# EasyEDA Pro project ProPrj_主控板v1.0_2025-02-24.epro, schematic Schematic3
Board Name: 主控扩展板V2.0; Create Date: 2025-01-02; Page Name: P1; Project Name: 主控板v1.0; Schematic Name: Schematic3; Update Date: 2025-01-03; Company: 嘉立创EDA; Page Size: A4; Version: V1.0
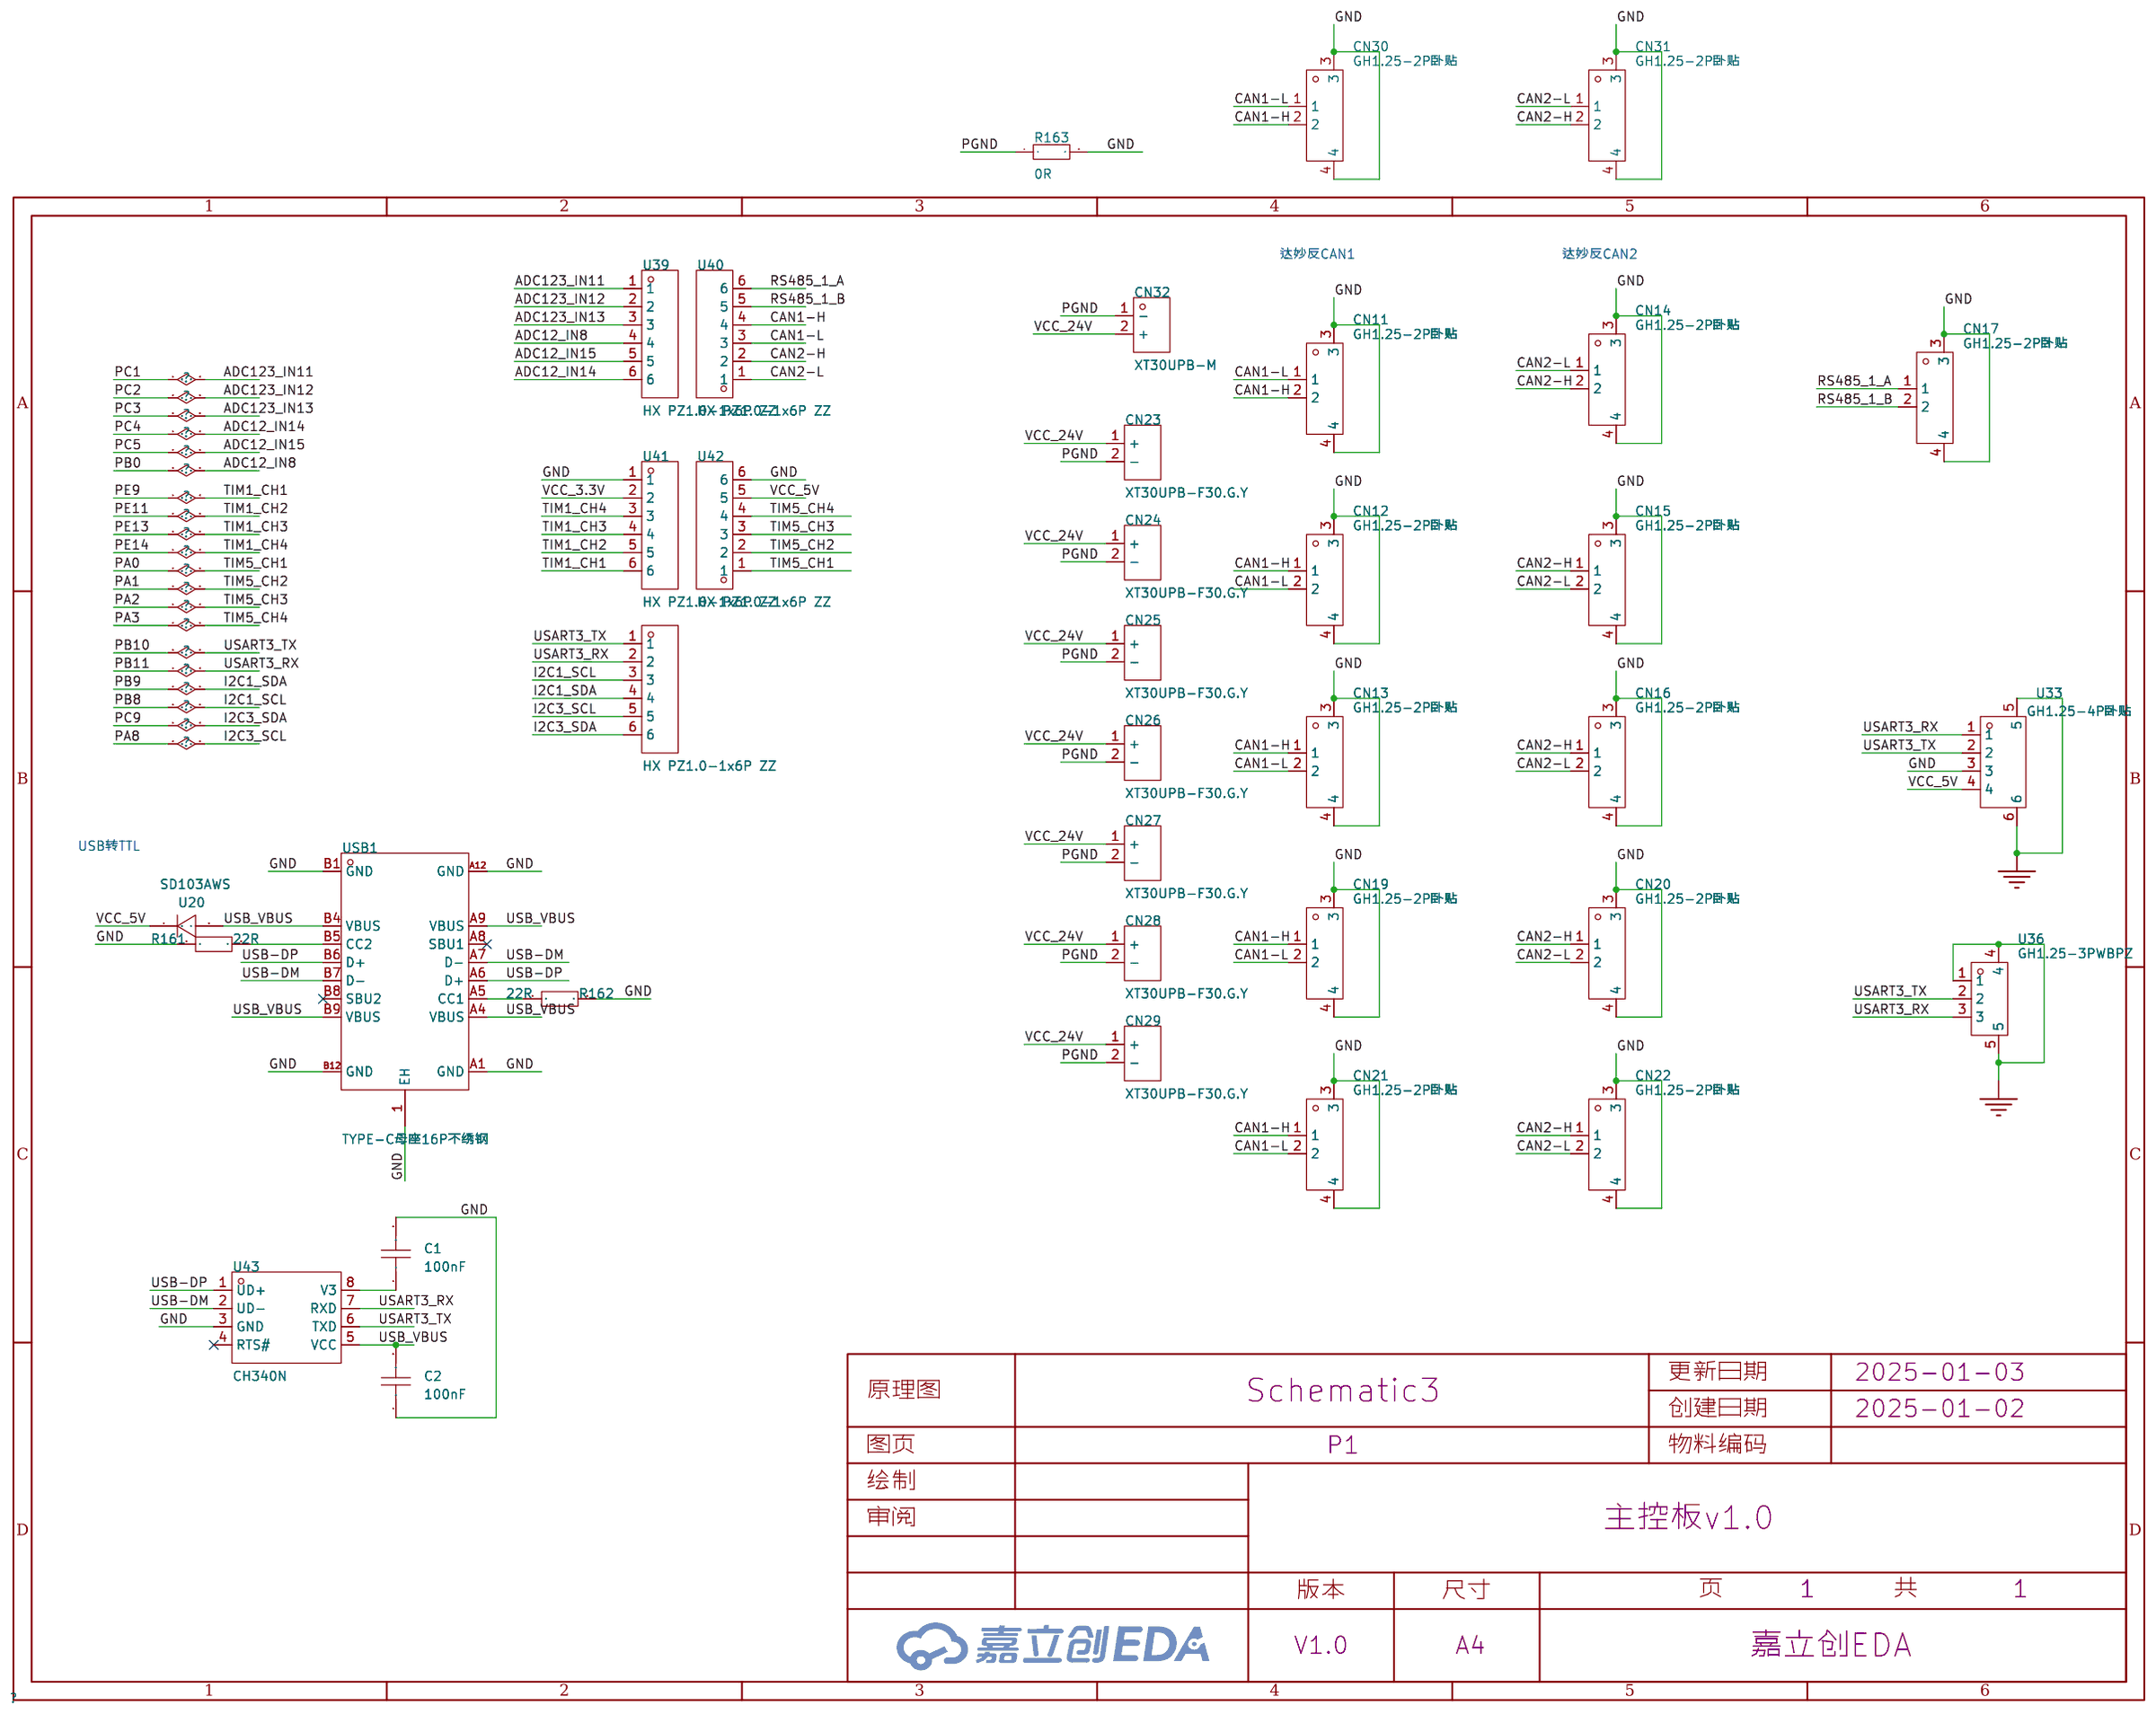
[diagram p7: schematic sheet]

## Parts
C1  100nF  [C0603]
C2  100nF  [C0603]
CN11  GH1.25-2P卧贴  [CONN-SMD_2P-P1.25_X1251WRS-02HF-LPSW]
CN12  GH1.25-2P卧贴  [CONN-SMD_2P-P1.25_X1251WRS-02HF-LPSW]
CN13  GH1.25-2P卧贴  [CONN-SMD_2P-P1.25_X1251WRS-02HF-LPSW]
CN14  GH1.25-2P卧贴  [CONN-SMD_2P-P1.25_X1251WRS-02HF-LPSW]
CN15  GH1.25-2P卧贴  [CONN-SMD_2P-P1.25_X1251WRS-02HF-LPSW]
CN16  GH1.25-2P卧贴  [CONN-SMD_2P-P1.25_X1251WRS-02HF-LPSW]
CN17  GH1.25-2P卧贴  [CONN-SMD_2P-P1.25_X1251WRS-02HF-LPSW]
CN19  GH1.25-2P卧贴  [CONN-SMD_2P-P1.25_X1251WRS-02HF-LPSW]
CN20  GH1.25-2P卧贴  [CONN-SMD_2P-P1.25_X1251WRS-02HF-LPSW]
CN21  GH1.25-2P卧贴  [CONN-SMD_2P-P1.25_X1251WRS-02HF-LPSW]
CN22  GH1.25-2P卧贴  [CONN-SMD_2P-P1.25_X1251WRS-02HF-LPSW]
CN23  XT30UPB-F30.G.Y  [CONN-TH_XT30UPB-F]
CN24  XT30UPB-F30.G.Y  [CONN-TH_XT30UPB-F]
CN25  XT30UPB-F30.G.Y  [CONN-TH_XT30UPB-F]
CN26  XT30UPB-F30.G.Y  [CONN-TH_XT30UPB-F]
CN27  XT30UPB-F30.G.Y  [CONN-TH_XT30UPB-F]
CN28  XT30UPB-F30.G.Y  [CONN-TH_XT30UPB-F]
CN29  XT30UPB-F30.G.Y  [CONN-TH_XT30UPB-F]
CN30  GH1.25-2P卧贴  [CONN-SMD_2P-P1.25_X1251WRS-02HF-LPSW]
CN31  GH1.25-2P卧贴  [CONN-SMD_2P-P1.25_X1251WRS-02HF-LPSW]
CN32  XT30UPB-M  [CONN-TH_XT30UPB-M]
R161  22R  [R0603]
R162  22R  [R0603]
R163  0R  [R0603]
U20  SD103AWS  [SOD-123_L2.7-W1.7-LS3.8-RD]
U33  GH1.25-4P卧贴  [CONN-SMD_4P-P1.25_GH1.25-4P]
U36  GH1.25-3PWBPZ  [CONN-SMD_GH1.25-3PWBPZ]
U38  HX PZ1.0-1x6P ZZ  [HDR-TH_6P-P1.00-V-M]
U39  HX PZ1.0-1x6P ZZ  [HDR-TH_6P-P1.00-V-M]
U40  HX PZ1.0-1x6P ZZ  [HDR-TH_6P-P1.00-V-M]
U41  HX PZ1.0-1x6P ZZ  [HDR-TH_6P-P1.00-V-M]
U42  HX PZ1.0-1x6P ZZ  [HDR-TH_6P-P1.00-V-M]
U43  CH340N  [SOP-8_L4.9-W3.9-P1.27-LS6.0-BL]
USB1  TYPE-C母座16P不绣钢  [TYPE-C-SMD_16P-EH4]

## Library data of the parts
C1 C2 = CAP_0603: Supplier Footprint: 0603
CN11-CN17 CN19-CN22 CN30 CN31 = GH1.25-2P卧贴_C9900015099: Supplier Part: C9900015099; JLCPCB Part Class: 扩展库; Supplier: LCSC
CN23-CN29 = XT30UPB-F30.G.Y: 模型插头连接器; LCSC Part Name: AMASS(艾迈斯)直立焊板式连接器XT30UPB30-F.G.*; Supplier Part: C108769; Manufacturer: AMASS(艾迈斯); JLCPCB Part Class: 扩展库; Datasheet: https://atta.szlcsc.com/upload/public/pdf/source/20220715/AFD68B9E8B6CA95A7295DBF4AF9325E4.pdf; Supplier: LCSC
CN32 = XT30UPB-M: 类别:-;类型1:-;; LCSC Part Name: AMASS(艾迈斯)板载立式 航模锂电池控制器连接器插头 公头XT30UPB-M; Supplier Part: C428721; Manufacturer: AMASS(艾迈斯); JLCPCB Part Class: 扩展库; Datasheet: https://atta.szlcsc.com/upload/public/pdf/source/20230412/7B5DFEF57C9EA5273853390C734B3AC5.pdf; Supplier: LCSC; Brand: 艾迈斯; Type: 航模插头; Colour: 黄色; RatedVoltage: DC 500V; InterfaceType: 公头; MetalMaterial: 镀金; InsulationMaterial: PA; RatedCurrent: 15A; contact resistance: 0.65mΩ
R161-R163 = Res_0603: Supplier Footprint: 0603
U20 = SD103AWS: Supplier Part: C9900016166; Supplier Footprint: 0805; JLCPCB Part Class: 扩展库; Supplier: LCSC
U33 = GH1.25-4P卧贴: Supplier Part: C9900014670; JLCPCB Part Class: 扩展库; Supplier: LCSC
U36 = GH1.25-3PWBPZ: LCSC Part Name: GH1.25-3P卧贴编带; Supplier Part: C2829252; Manufacturer: BOOMELE(博穆精密); JLCPCB Part Class: 扩展库; Datasheet: https://atta.szlcsc.com/upload/public/pdf/source/20211125/08A09A4909F58AF780B71FE423A00F7E.pdf; Supplier: LCSC
U38-U42 = HX PZ1.0-1x6P ZZ: 插针结构:1x6P;间距:1mm;行距:-;圆针/方针:方针;安装类型:直插;排数:单排;总PIN位数:6P;额定电流:750mA;额定电压:-;配合针长度:2mm;塑高:1mm;端接针长度:2mm;触头材质:磷青铜;触头镀层:金;工作温度范围:-40℃~+105℃;颜色:黑色;; LCSC Part Name: 1x6P 间距:1mm 方针 直插; Supplier Part: C22438174; Manufacturer: hanxia(韩下); Supplier Footprint: 插件,P=1mm; JLCPCB Part Class: 扩展库; Datasheet: https://atta.szlcsc.com/upload/public/pdf/source/20240522/DE793C8689D5607D09D1F00E564F7D8C.pdf; Supplier: LCSC; Pin Structure: 1x6P; Pitch: 1mm; Circluar Pins/Square Pins: 方针; Mounting Type: 直插; Number of Rows: 单排; Number of Pins: 6P; Current Rating (Max): 750mA; Length of Mating Pin: 2mm; Insulation Height: 1mm; Length of End Connection Pin: 2mm; Contact Material: 磷青铜; Contact Plating: 金; Operating Temperature Range: -40℃~+105℃; Color: 黑色
U43 = CH340N: 应用功能:USB转串口;接口协议:USB 2.0;通道数:1;数据速率:2Mbps;; LCSC Part Name: USB转串口芯片CH340; Supplier Part: C2977777; Manufacturer: WCH(南京沁恒); Supplier Footprint: SOP-8; JLCPCB Part Class: 扩展库; Datasheet: https://atta.szlcsc.com/upload/public/pdf/source/20240313/115CDE92081B1D6CB446704AD5D0F5F2.pdf; Supplier: LCSC; Applications Function: USB转串口; Protocol: USB 2.0; Number of Channels: 1; Supply Voltage: 3.3V；5V; Data Rate: 2Mbps; Operating Temperature: -20℃~+70℃
USB1 = TYPE-C母座16P不绣钢: Supplier Part: C9900003726; Supplier Footprint: TYPE-C-SMD_16P-L8.94-W7.35-P0.50; JLCPCB Part Class: 扩展库; Supplier: LCSC

## Nets
GND: C1.2 C2.1 CN11.3 CN11.4 CN12.3 CN12.4 CN13.3 CN13.4 CN14.3 CN14.4 CN15.3 CN15.4 CN16.3 CN16.4 CN17.3 CN17.4 CN19.3 CN19.4 CN20.3 CN20.4 CN21.3 CN21.4 CN22.3 CN22.4 CN30.3 CN30.4 CN31.3 CN31.4 R161.1 R162.2 R163.2 U33.3 U33.5 U33.6 U36.1 U36.4 U36.5 U41.1 U42.6 U43.3(GND) USB1.1(EH) USB1.A1(GND) USB1.A12(GND) USB1.B1(GND) USB1.B12(GND)
PGND: CN23.2(-) CN24.2(-) CN25.2(-) CN26.2(-) CN27.2(-) CN28.2(-) CN29.2(-) CN32.1(-) R163.1
VCC_3.3V: U41.2
VCC_5V: U20.1(C) U33.4 U42.5
VCC_24V: CN23.1(+) CN24.1(+) CN25.1(+) CN26.1(+) CN27.1(+) CN28.1(+) CN29.1(+) CN32.2(+)
ADC12_IN8: U39.4
ADC12_IN14: U39.6
ADC12_IN15: U39.5
ADC123_IN11: U39.1
ADC123_IN12: U39.2
ADC123_IN13: U39.3
CAN1-H: CN11.2 CN12.1 CN13.1 CN19.1 CN21.1 CN30.2 U40.4
CAN1-L: CN11.1 CN12.2 CN13.2 CN19.2 CN21.2 CN30.1 U40.3
CAN2-H: CN14.2 CN15.1 CN16.1 CN20.1 CN22.1 CN31.2 U40.2
CAN2-L: CN14.1 CN15.2 CN16.2 CN20.2 CN22.2 CN31.1 U40.1
I2C1_SCL: U38.3
I2C1_SDA: U38.4
I2C3_SCL: U38.5
I2C3_SDA: U38.6
PA0: U42.1
PA1: U42.2
PA2: U42.3
PA3: U42.4
PB10: U33.2 U36.2 U38.1 U43.6(TXD)
PB11: U33.1 U36.3 U38.2 U43.7(RXD)
PE9: U41.6
PE11: U41.5
PE13: U41.4
PE14: U41.3
RS485_1_A: CN17.1 U40.6
RS485_1_B: CN17.2 U40.5
USB-DM: U43.2(UD-) USB1.A7(D-) USB1.B7(D-)
USB-DP: U43.1(UD+) USB1.A6(D+) USB1.B6(D+)
USB_VBUS: C2.2 U20.2(A) U43.5(VCC) USB1.A4(VBUS) USB1.A9(VBUS) USB1.B4(VBUS) USB1.B9(VBUS)
$1N1630: R162.1 USB1.A5(CC1)
$1N1647: R161.2 USB1.B5(CC2)
$1N2015: C1.1 U43.8(V3)

Not connected (* = marked no-connect by the designer): U43 4(RTS#)*; USB1 A8(SBU1)* B8(SBU2)*

## Notes on the sheet
- 达妙反CAN1
- 达妙反CAN2
- USB转TTL
